# Altium project gap9_deck_v2.PrjPcb (part 2 of 2)

## Sheet 07_NINA-WIFI.SchDoc: GAP9Shield
size A3; DrawnBy: Hanna Müller and Victor Kartsch; Organization: Integrated Systems Laboratory; DocumentNumber: 7; Revision: v1.0; SheetNumber: 7; SheetTotal: 9
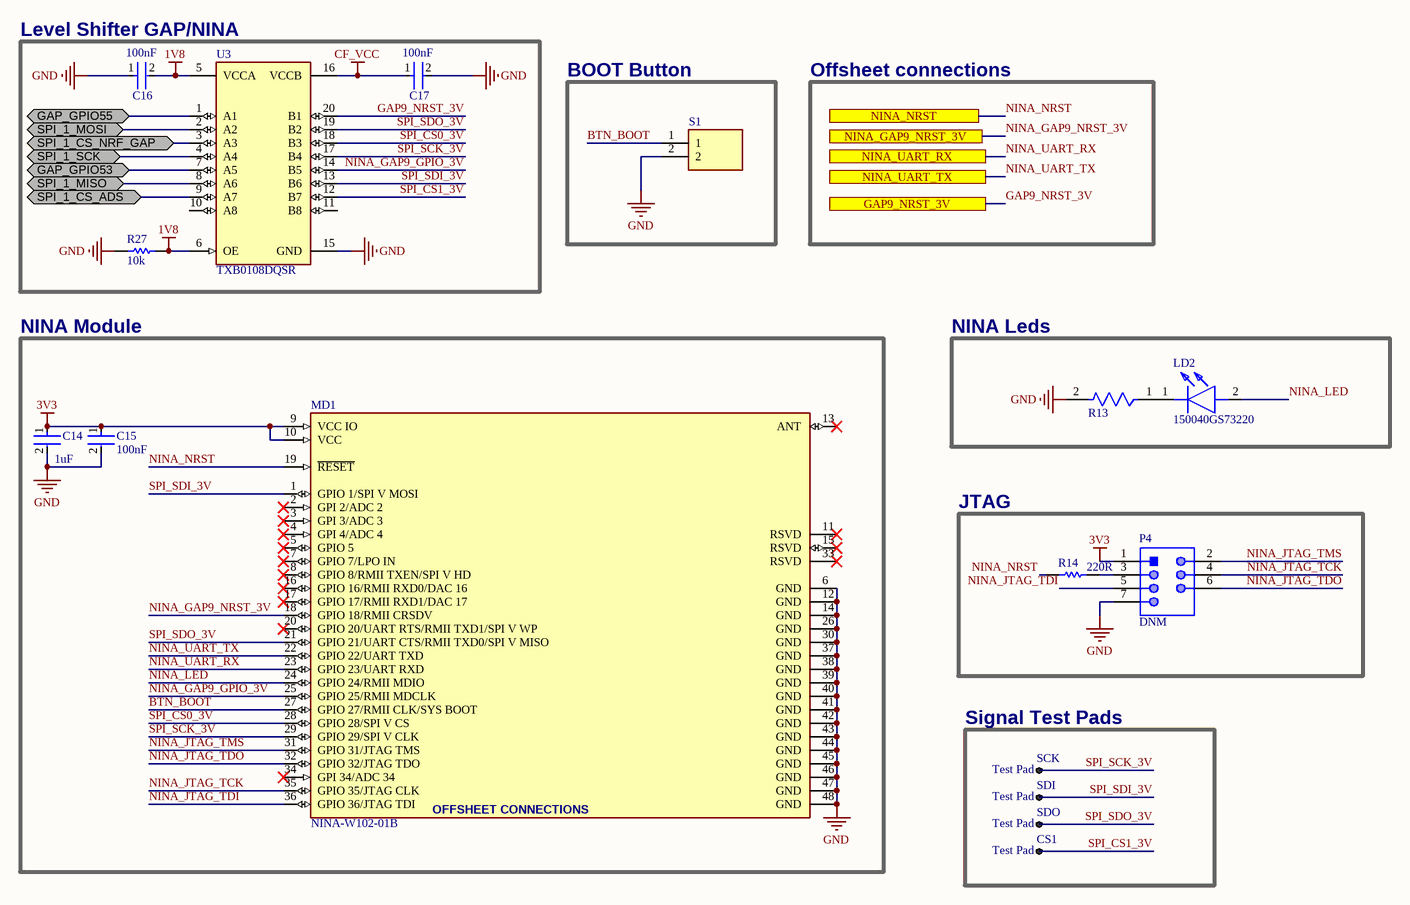
[diagram p6: 07_NINA-WIFI.SchDoc]

### Parts
C14  value 1uF  [FP-GRM155-0_05-IPC_B]  (hidden comment: GRM155R61E105MA12D)
C15  value 100nF  [FP-C1005-050-0_05-MFG]  (hidden comment: C1005X5R1E104K050BC)
C16  value 100nF  [FP-C1005-050-0_05-MFG]  (hidden comment: C1005X5R1E104K050BC)
C17  value 100nF  [FP-C1005-050-0_05-MFG]  (hidden comment: C1005X5R1E104K050BC)
CS1  Test Pad  [Pad-1.5mm]  (no BOM)
LD2  150040GS73220  [150040GS73220]
MD1  NINA-W102-01B  [FP-NINA-W102-00B-00-MFG]
P4  DNM  [JTAG_MINI]
R13  RC0201JR-070RL  [FP-RC_L0201-MFG]  (value not drawn)
R14  value 220R  [RESC0603X28X15ML05T05]  (hidden comment: CRCW0201220RFKED)
R27  value 10k  [RESC0603X28X15LL05T05]  (hidden comment: CRCW020110K0FNED)
S1  TS19-32-06-BK-70-1-SMT-TR-67  [TS193206BK701SMTTR67]  (value not drawn)
SCK  Test Pad  [Pad-1.5mm]  (no BOM)
SDI  Test Pad  [Pad-1.5mm]  (no BOM)
SDO  Test Pad  [Pad-1.5mm]  (no BOM)
U3  TXB0108DQSR  [FP-DQS0020A-MFG]

### Blocks framed on the sheet
Level Shifter GAP/NINA: C16 C17 R27 U3
BOOT Button: S1
NINA Module: C14 C15 MD1
NINA Leds: LD2 R13
JTAG: P4 R14
Signal Test Pads: CS1 SCK SDI SDO

### Ports
GAP9_NRST_3V, GAP_GPIO53 (bidir), GAP_GPIO55 (bidir), NINA_GAP9_NRST_3V, NINA_NRST, NINA_UART_RX, NINA_UART_TX, SPI_1_CS_ADS (bidir), SPI_1_CS_NRF_GAP (bidir), SPI_1_MISO (bidir), SPI_1_MOSI (bidir), SPI_1_SCK (bidir)

### Nets
1V8: C16.2 R27.1 U3.5(VCCA) U3.6(OE)
3V3: C14.1 C15.1 MD1.9(VCC_IO) MD1.10(VCC) P4.1
CF_VCC: C17.1 U3.16(VCCB)
GND: C14.2 C15.2 C16.1 C17.2 MD1.6(GND) MD1.12(GND) MD1.14(GND) MD1.26(GND) MD1.30(GND) MD1.37(GND) MD1.38(GND) MD1.39(GND) MD1.40(GND) MD1.41(GND) MD1.42(GND) MD1.43(GND) MD1.44(GND) MD1.45(GND) MD1.46(GND) MD1.47(GND) MD1.48(GND) P4.7 R13.2 R27.2 S1.2 U3.15(GND)
BTN_BOOT: MD1.27(GPIO_27/RMII_CLK/SYS_BOOT) S1.1
GAP9_NRST_3V: U3.20(B1) ; port GAP9_NRST_3V
GAP_GPIO53: U3.7(A5) ; port GAP_GPIO53
GAP_GPIO55: U3.1(A1) ; port GAP_GPIO55
NINA_GAP9_GPIO_3V: MD1.25(GPIO_25/RMII_MDCLK) U3.14(B5)
NINA_GAP9_NRST_3V: MD1.18(GPIO_18/RMII_CRSDV) ; port NINA_GAP9_NRST_3V
NINA_JTAG_TCK: MD1.35(GPIO_35/JTAG_CLK) P4.4
NINA_JTAG_TDI: MD1.36(GPIO_36/JTAG_TDI) P4.5
NINA_JTAG_TDO: MD1.32(GPIO_32/JTAG_TDO) P4.6
NINA_JTAG_TMS: MD1.31(GPIO_31/JTAG_TMS) P4.2
NINA_LED: LD2.2(A) MD1.24(GPIO_24/RMII_MDIO)
NINA_NRST: MD1.19(~{RESET}) R14.2 ; port NINA_NRST
NINA_UART_RX: MD1.23(GPIO_23/UART_RXD) ; port NINA_UART_RX
NINA_UART_TX: MD1.22(GPIO_22/UART_TXD) ; port NINA_UART_TX
SPI_1_CS_ADS: U3.9(A7) ; port SPI_1_CS_ADS
SPI_1_CS_NRF_GAP: U3.3(A3) ; port SPI_1_CS_NRF_GAP
SPI_1_MISO: U3.8(A6) ; port SPI_1_MISO
SPI_1_MOSI: U3.2(A2) ; port SPI_1_MOSI
SPI_1_SCK: U3.4(A4) ; port SPI_1_SCK
SPI_CS0_3V: MD1.28(GPIO_28/SPI_V_CS) U3.18(B3)
SPI_CS1_3V: CS1.1 U3.12(B7)
SPI_SCK_3V: MD1.29(GPIO_29/SPI_V_CLK) SCK.1 U3.17(B4)
SPI_SDI_3V: MD1.1(GPIO_1/SPI_V_MOSI) SDI.1 U3.13(B6)
SPI_SDO_3V: MD1.21(GPIO_21/UART_CTS/RMII_TXD0/SPI_V_MISO) SDO.1 U3.19(B2)
NetLD2_1: LD2.1(K) R13.1
NetP4_3: P4.3 R14.1

Not connected (* = marked no-connect by the designer): MD1 2(GPI_2/ADC_2)* 3(GPI_3/ADC_3)* 4(GPI_4/ADC_4)* 5(GPIO_5)* 7(GPIO_7/LPO_IN)* 8(GPIO_8/RMII_TXEN/SPI_V_HD)* 11(RSVD)* 13(ANT)* 15(RSVD)* 16(GPIO_16/RMII_RXD0/DAC_16)* 17(GPIO_17/RMII_RXD1/DAC_17)* 20(GPIO_20/UART_RTS/RMII_TXD1/SPI_V_WP)* 33(RSVD)* 34(GPI_34/ADC_34)*; U3 10(A8) 11(B8)

### Notes on the sheet
- Offsheet connections
- (near MD1) OFFSHEET CONNECTIONS
- 1
- 2
- 3
- 4
- 5
- 6
- 7
- 8
- A
- B
- C
- D
- Project:
- Date:
- Drawing number:
- Rev:
- Format:
- A3
- Drawn by:
- Laboratory:
- Page
- Sheet:
- of
- File:

### Library data of the parts
C14 = CMP-06035-012395-1: Chip Multilayer Ceramic Capacitors for General Purpose, 0402, 1.0uF, X5R, 15%, 20%, 25V; Weight: 0.000212oz; Dielectric: X5R; Case Code (Metric): 1005; Thickness: 0.022inch; Min Operating Temperature: -55°C; Voltage Rating (DC): 25V; Lead Free: Lead Free; Voltage Rating: 25V; Max Operating Temperature: 85°C; Case/Package: 0402; Packaging: Tape and Reel; Package Quantity: 10000; Termination: SMD/SMT; Height: 0.5mm; Width: 0.5mm; Mount: Surface Mount; Case Code (Imperial): 0402; Tolerance: 20%; Capacitance: 1uF; Length: 0.039inch
C15-C17 = CMP-2000-06000-2: Multilayer Ceramic Capacitors 100nF ±10% 25V X5R SMD 0402; Case Code (Imperial): 0402; Termination: Wraparound; Series: C; Depth: 0.5mm; Voltage Rating (DC): 25V; Contact Plating: Tin; Case Code (Metric): 1005; Dielectric: X5R; Case/Package: 0402; Voltage Rating: 25V; Packaging: Tape and Reel; Thickness: 0.022inch; Dielectric Material: Ceramic; Height: 0.5mm; Weight: 2.3E-05oz; RoHS Compliant: Yes; Width: 0.02inch; Capacitance: 100nF; Tolerance: 10%; Mount: Surface Mount; Package Quantity: 1; Max Operating Temperature: 85°C; Construction: Flat; Min Operating Temperature: -55°C; REACH SVHC: No SVHC; Resistor Type: Ceramic; Length: 1mm; Lead Free: Lead Free; Voltage: 25V
CS1 SCK SDI SDO = CMP-01283-1: 1mm SMT Test Pad; Mounting Technology: SMT
LD2 = 150040GS73220: LED; Manufacturer_Name: Wurth Elektronik; Datasheet Link: https://www.mouser.com/datasheet/2/445/150040GS73220-1714597.pdf; Height: 0.35mm; Manufacturer_Part_Number: 150040GS73220; Mouser Part Number: 710-150040GS73220; Mouser Price/Stock: https://www.mouser.co.uk/ProductDetail/Wurth-Elektronik/150040GS73220?qs=u16ybLDytRZ9vktXLUK1Kg%3D%3D
MD1 = CMP-207130-000007-1: STAND-ALONE MULTIRADIO MODULES; Manufacturer Part Number: NINA-W102-00B-00; Manufacturer: U-Blox; Max Supply Voltage: 3.6V; Number Of Adc Channels: 17; Receiving Current: 100-140mA; Nominal Supply Current: 30-190mA; Data Rate: 100Mbits/s; Max Frequency: 2.5GHz; Sensitivity: -96dBm; Min Supply Voltage: 3V; Interface: I2C,SPI,UART,CAN,Ethernet,I2S,Other; Bandwidth: 20MHz; Transmitting Current: 225-320mA; Number Of Gpio: 20; Device Class L3: Transceivers; Octopart: https://octopart.com/nina-w102-00b-00-u-blox-103157672; Automotive: No; Category: UNK; Temperature: -40°C to +85°C; Lead Free: Yes; Device Class L1: Integrated Circuits (ICs); ComponentLink2Description: Datasheet; Temperature Range Low: -40°C; Package: 0; Temperature Range High: +85°C; Digikey Description: STAND-ALONE MULTIRADIO MODULES; Device Class L2: RF Semiconductors and Devices; ComponentLink2URL: https://www.u-blox.com/sites/default/files/NINA-W10_DataSheet_%28UBX-17065507%29.pdf; RoHS: TRUE; Height: 4.2mm
P4 = JTAG_MINI: 2x10 Pin 50mil Header; PN: 20021111-00010T4LF; Supplier 1: Digi-Key; Supplier Part Number 1: 732-5374-ND
R13 = CMP-03412-023265-1: RES SMD 0 OHM JUMPER 1/20W 0201; Manufacturer: Yageo; Power Rating: 50mW; Value: 0Ω; Temperature Coefficient: 200ppm/°C; Voltage Rating: 25V; Tolerance: 5%; Octopart: https://octopart.com/rc0201jr-070rl-yageo-43171986; ComponentLink2URL: http://www.yageo.com/documents/recent/PYu-RC_Group_51_RoHS_L_10.pdf; Device Class L2: Resistors; Series: RC_L; Ipc Land Pattern Name: RESC6030X23; Temperature: -55°C to +125°C; Mouser Description: Thick Film Resistors ZERO OHM JUMPER; Footprint Url: http://www.yageo.com/exep/pages/download/literatures/PYu-R_Mount_10.pdf; RoHS: TRUE; Package: RC_L0201; Device Class L3: Chip SMD Resistors; Temperature Range Low: -55°C; Composition: Thick Film; ComponentLink2Description: Datasheet; Height: 0.26mm; Device Class L1: Passive Components; Category: Res; Resistance: 0Ω; Manufacturer Part Number: RC0201JR-070RL; Temperature Range High: +125°C; Automotive: No; Lead Free: Yes; Digikey Description: RES SMD 0 OHM JUMPER 1/20W 0201
R14 = CMP-2004-00982-1: Manufacturer: Vishay Dale; Part Number: CRCW0201220RFKED
R27 = CMP-2004-00016-1: Manufacturer: Vishay Dale; Part Number: CRCW020110K0FNED
S1 = TS19-32-06-BK-70-1-SMT-TR-67: Switch; Manufacturer_Name: CUI Devices; Datasheet Link: https://www.cuidevices.com/product/resource/ts19.pdf; Height: 0.65mm; Manufacturer_Part_Number: TS19-32-06-BK-70-1-SMT-TR-67; Mouser Part Number: 179-TS193206BK701SM; Mouser Price/Stock: https://www.mouser.co.uk/ProductDetail/CUI-Devices/TS19-32-06-BK-70-1-SMT-TR-67?qs=tlsG%2FOw5FFj0aJkgA5InKg%3D%3D
U3 = CMP-04899-000009-1: IC TRNSLTR BIDIRECTIONAL 20USON; Manufacturer: Texas Instruments; Nominal Supply Current: 0.05-3.5uA; Propagation Delay: 4ns; Max Supply Voltage: 5.5V; V A Min: 1.2V; Max Junction Temp: +150°C; Logic Function Desc: Non-Inverting; Number Of Inputs: 1; V A Max: 3.6V; Number Of Circuits: 8; V B Min: 1.65V; Standoff Height: 0mm; Data Rate: 100Mbits/s; Automotive: No; Mouser Description: Translation - Voltage Levels 8B Bidir Vltg-Level Translator; Category: IC; Temperature Range Low: -40°C; Package: DQS0020A; Manufacturer Part Number: TXB0108DQSR; ComponentLink2Description: Datasheet; Device Class L3: Voltage Level Shifters; Device Class L2: Logic ICs; Temperature Range High: +85°C; Digikey Description: IC TRNSLTR BIDIRECTIONAL 20USON; Octopart: https://octopart.com/txb0108dqsr-texas+instruments-18562890; RoHS: TRUE; Ambient Temperature Range High: +85°C; Lead Free: Yes; V B Max: 5.5V; ComponentLink2URL: https://www.ti.com/lit/ds/symlink/txb0108.pdf; Height: 0.55mm; Ambient Temperature Range Low: -40°C; Temperature: -40°C to +85°C; Number Of Outputs: 1; Min Supply Voltage: 1.2V; Device Class L1: Integrated Circuits (ICs)

## Sheet 08_CF_INTERFACE.SchDoc: GAP9Shield
size A3; DrawnBy: Hanna Müller and Victor Kartsch; Organization: Integrated Systems Laboratory; DocumentNumber: 8; Revision: v1.0; SheetNumber: 8; SheetTotal: 9
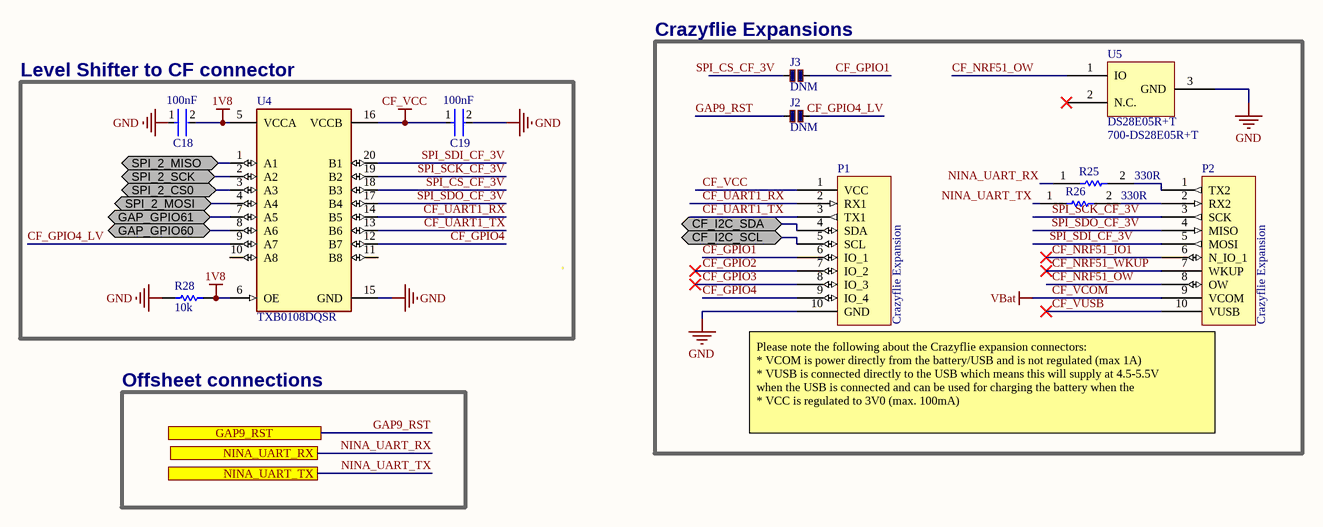
[diagram p7: 08_CF_INTERFACE.SchDoc]

### Parts
C18  value 100nF  [FP-C1005-050-0_05-MFG]  (hidden comment: C1005X5R1E104K050BC)
C19  value 100nF  [FP-C1005-050-0_05-MFG]  (hidden comment: C1005X5R1E104K050BC)
J2  DNM  [Small Solder Jumper]
J3  DNM  [Small Solder Jumper]
P1  Crazyflie Expansion  [CF2-DECK-SMD-HOLES]
P2  Crazyflie Expansion  [CF2-DECK-SMD-HOLES]
R25  value 330R  [H2C/H2R]  (hidden comment: ERJ-H2RD3300X)
R26  value 330R  [H2C/H2R]  (hidden comment: ERJ-H2RD3300X)
R28  value 10k  [RESC0603X28X15LL05T05]  (hidden comment: CRCW020110K0FNED)
U4  TXB0108DQSR  [FP-DQS0020A-MFG]
U5  DS28E05R+T  Supplier Part Number 1: 700-DS28E05R+T  [SOT23-3]

### Blocks framed on the sheet
Crazyflie Expansions: J2 J3 P1 P2 R25 R26 U5
Level Shifter to CF connector: C18 C19 R28 U4

### Ports
CF_I2C_SCL (bidir), CF_I2C_SDA (bidir), GAP9_RST, GAP_GPIO60 (bidir), GAP_GPIO61 (bidir), NINA_UART_RX, NINA_UART_TX, SPI_2_CS0 (bidir), SPI_2_MISO (bidir), SPI_2_MOSI (bidir), SPI_2_SCK (bidir)

### Nets
1V8: C18.2 R28.1 U4.5(VCCA) U4.6(OE)
CF_VCC: C19.1 P1.1(VCC) U4.16(VCCB)
CF_VCOM: P2.9(VCOM)  [also labelled VBat]
GND: C18.1 C19.2 P1.10(GND) R28.2 U4.15(GND) U5.3(GND)
CF_GPIO1: J3.1 P1.6(IO_1)
CF_GPIO2: P1.7(IO_2)
CF_GPIO3: P1.8(IO_3)
CF_GPIO4: P1.9(IO_4) U4.12(B7)
CF_GPIO4_LV: J2.1 U4.9(A7)
CF_NRF51_IO1: P2.6(N_IO_1)
CF_NRF51_OW: P2.8(OW) U5.1(IO)
CF_NRF51_WKUP: P2.7(WKUP)
CF_UART1_RX: P1.2(RX1) U4.14(B5)
CF_UART1_TX: P1.3(TX1) U4.13(B6)
CF_VUSB: P2.10(VUSB)
GAP9_RST: J2.2 ; port GAP9_RST
GAP_GPIO56: U4.2(A2) ; port SPI_2_SCK
GAP_GPIO57_NRF_P0.18: U4.3(A3) ; port SPI_2_CS0
GAP_GPIO58: U4.1(A1) ; port SPI_2_MISO
GAP_GPIO59: U4.4(A4) ; port SPI_2_MOSI
GAP_GPIO60: U4.8(A6) ; port GAP_GPIO60
GAP_GPIO61: U4.7(A5) ; port GAP_GPIO61
NINA_UART_RX: R25.1 ; port NINA_UART_RX
NINA_UART_TX: R26.1 ; port NINA_UART_TX
SPI_CS_CF_3V: J3.2 U4.18(B3)
SPI_SCK_CF_3V: P2.3(SCK) U4.19(B2)
SPI_SDI_CF_3V: P2.5(MOSI) U4.20(B1)
SPI_SDO_CF_3V: P2.4(MISO) U4.17(B4)
NetJ6_1: P1.4(SDA) ; port CF_I2C_SDA
NetJ8_1: P1.5(SCL) ; port CF_I2C_SCL
NetP2_1: P2.1(TX2) R25.2
NetP2_2: P2.2(RX2) R26.2

Not connected (* = marked no-connect by the designer): U4 10(A8) 11(B8); U5 2(N.C.)*

### Notes on the sheet
- Offsheet connections
- Please note the following about the Crazyflie expansion connectors:
  * VCOM is power directly from the battery/USB and is not regulated (max 1A)
  * VUSB is connected directly to the USB which means this will supply at 4.5-5.5V
  when the USB is connected and can be used for charging the battery when the
  * VCC is regulated to 3V0 (max. 100mA)
- 1
- 2
- 3
- 4
- 5
- 6
- 7
- 8
- A
- B
- C
- D
- Project:
- Date:
- Drawing number:
- Rev:
- Format:
- A3
- Drawn by:
- Laboratory:
- Page
- Sheet:
- of
- File:

### Library data of the parts
C18 C19 = CMP-2000-06000-2: as C15 on sheet 07_NINA-WIFI; Case Code (Imperial): 0402; Termination: Wraparound; Series: C; Depth: 0.5mm; Voltage Rating (DC): 25V; Contact Plating: Tin; Case Code (Metric): 1005; Dielectric: X5R; Case/Package: 0402; Voltage Rating: 25V; Packaging: Tape and Reel; Thickness: 0.022inch; Dielectric Material: Ceramic; Height: 0.5mm; Weight: 2.3E-05oz; RoHS Compliant: Yes; Width: 0.02inch; Capacitance: 100nF; Tolerance: 10%; Mount: Surface Mount; Package Quantity: 1; Max Operating Temperature: 85°C; Construction: Flat; Min Operating Temperature: -55°C; REACH SVHC: No SVHC; Resistor Type: Ceramic; Length: 1mm; Lead Free: Lead Free; Voltage: 25V
J2 J3 = CMP-00005-5: Technology: SMT
P1 = CF_EXP_LEFT: Supplier 1: Digi-Key; Supplier Part Number 1: 110990442-ND
P2 = CF_EXP_RIGHT: Supplier 1: Digi-Key; Supplier Part Number 1: 110990442-ND
R25 R26 = ERJ-H2RD3300X: Resistor; Manufacturer_Name: Panasonic; Datasheet Link: http://industrial.panasonic.com/cdbs/www-data/pdf/RDQ0000/ast-ind-151033.pdf; Manufacturer_Part_Number: ERJ-H2RD3300X; Mouser Part Number: 667-ERJ-H2RD3300X; Mouser Price/Stock: https://www.mouser.co.uk/ProductDetail/Panasonic/ERJ-H2RD3300X?qs=eP2BKZSCXI6Pijj457e9wg%3D%3D
R28 = CMP-2004-00016-1: Manufacturer: Vishay Dale; Part Number: CRCW020110K0FNED
U4 = CMP-04899-000009-1: as U3 on sheet 07_NINA-WIFI; Automotive: No; Mouser Description: Translation - Voltage Levels 8B Bidir Vltg-Level Translator; Category: IC; Temperature Range Low: -40°C; Package: DQS0020A; Manufacturer Part Number: TXB0108DQSR; ComponentLink2Description: Datasheet; Device Class L3: Voltage Level Shifters; Device Class L2: Logic ICs; Temperature Range High: +85°C; Digikey Description: IC TRNSLTR BIDIRECTIONAL 20USON; Octopart: https://octopart.com/txb0108dqsr-texas+instruments-18562890; RoHS: TRUE; Ambient Temperature Range High: +85°C; Lead Free: Yes; V B Max: 5.5V; ComponentLink2URL: https://www.ti.com/lit/ds/symlink/txb0108.pdf; Height: 0.55mm; Ambient Temperature Range Low: -40°C; Temperature: -40°C to +85°C; Number Of Outputs: 1; Min Supply Voltage: 1.2V; Device Class L1: Integrated Circuits (ICs)
U5 = DS28E05R+T: EEPROM 1-Wire 112-BYTE; Supplier 1: Mouser

## Sheet 09_POWER.SchDoc: GAP9Shield
size A3; DrawnBy: Hanna Müller and Victor Kartsch; Organization: Integrated Systems Laboratory; DocumentNumber: 9; Revision: v1.0; SheetNumber: 9; SheetTotal: 9
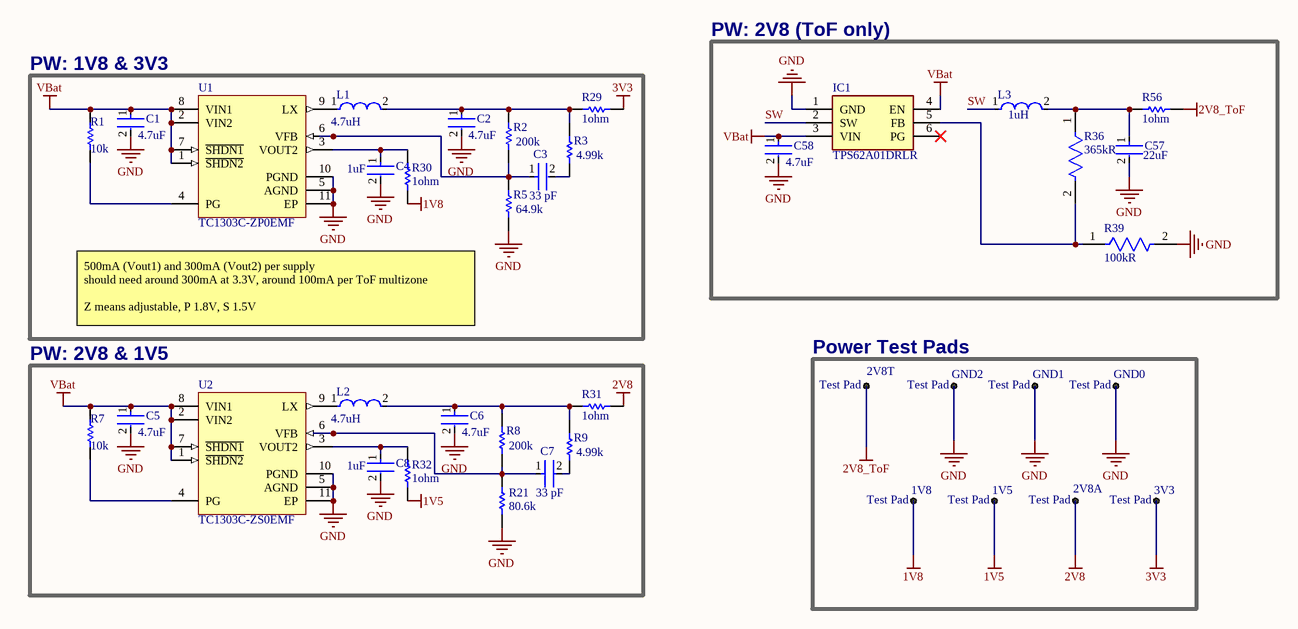
[diagram p8: 09_POWER.SchDoc]

### Parts
1V5  Test Pad  [Pad-1.5mm]  (no BOM)
1V8  Test Pad  [Pad-1.5mm]  (no BOM)
2V8A  Test Pad  [Pad-1.5mm]  (no BOM)
2V8T  Test Pad  [Pad-1.5mm]  (no BOM)
3V3  Test Pad  [Pad-1.5mm]  (no BOM)
C1  value 4.7uF  [FP-C1005-050-0_15-MFG]  (hidden comment: C1005X5R0J475K050BC)
C2  value 4.7uF  [FP-C1005-050-0_15-MFG]  (hidden comment: C1005X5R0J475K050BC)
C3  value 33 pF  [FP-C0402-BB-MFG]  (hidden comment: C0402C330J5GAC)
C4  value 1uF  [FP-GRM155-0_05-IPC_B]  (hidden comment: GRM155R61E105MA12D)
C5  value 4.7uF  [FP-C1005-050-0_15-MFG]  (hidden comment: C1005X5R0J475K050BC)
C6  value 4.7uF  [FP-C1005-050-0_15-MFG]  (hidden comment: C1005X5R0J475K050BC)
C7  value 33 pF  [FP-C0402-BB-MFG]  (hidden comment: C0402C330J5GAC)
C8  value 1uF  [FP-GRM155-0_05-IPC_B]  (hidden comment: GRM155R61E105MA12D)
C57  value 22uF  [FP-GRM158-0_2-IPC_A]  (hidden comment: GRM158R60J226ME01D)
C58  value 4.7uF  [FP-C1005-050-0_15-MFG]  (hidden comment: C1005X5R0J475K050BC)
GND0  Test Pad  [Pad-1.5mm]  (no BOM)
GND1  Test Pad  [Pad-1.5mm]  (no BOM)
GND2  Test Pad  [Pad-1.5mm]  (no BOM)
IC1  TPS62A01DRLR  [SOTFL50P160X60-6N]
L1  Inductance: 4.7uH  [FP-LQM18FN_00-IPC_A]  (hidden comment: LQM18FN4R7M00D)
L2  Inductance: 4.7uH  [FP-LQM18FN_00-IPC_A]  (hidden comment: LQM18FN4R7M00D)
L3  value 1uH  [FP-CBL2012-MFG]  (hidden comment: CBL2012T1R0M)
R1  value 10k  [RESC0603X28X15LL05T05]  (hidden comment: CRCW020110K0FNED)
R2  value 200k  [RESC0603X28X15NL05T05]  (hidden comment: CRCW0201200KFKED)
R3  value 4.99k  [RESC0603X28X15ML05T05]  (hidden comment: CRCW02014K99FKED)
R5  value 64.9k  [RESC0603X28X15LL05T05]  (hidden comment: CRCW020164K9FKED)
R7  value 10k  [RESC0603X28X15LL05T05]  (hidden comment: CRCW020110K0FNED)
R8  value 200k  [RESC0603X28X15NL05T05]  (hidden comment: CRCW0201200KFKED)
R9  value 4.99k  [RESC0603X28X15ML05T05]  (hidden comment: CRCW02014K99FKED)
R21  value 80.6k  [RESC0603X28X15NL05T05]  (hidden comment: CRCW020180K6FNED)
R29  value 1ohm  [RESC1005X40X25ML05T10]  (hidden comment: CRCW04021R00FKEDHP)
R30  value 1ohm  [RESC1005X40X25ML05T10]  (hidden comment: CRCW04021R00FKEDHP)
R31  value 1ohm  [RESC1005X40X25ML05T10]  (hidden comment: CRCW04021R00FKEDHP)
R32  value 1ohm  [RESC1005X40X25ML05T10]  (hidden comment: CRCW04021R00FKEDHP)
R36  value 365kR  [FP-CR0402-IPC_A]  (hidden comment: CR0402-FX-3653GLF)
R39  value 100kR  [FP-ERJ2RK-IPC_C]  (hidden comment: ERJ-2RKF1003X)
R56  value 1ohm  [RESC1005X40X25ML05T10]  (hidden comment: CRCW04021R00FKEDHP)
U1  TC1303C-ZP0EMF  [DFN-MF10]
U2  TC1303C-ZS0EMF  [DFN-MF10]

### Blocks framed on the sheet
PW: 1V8 & 3V3: C1-C4 L1 R1-R3 R5 R29 R30 U1
PW: 2V8 (ToF only): C57 C58 IC1 L3 R36 R39 R56
Power Test Pads: 1V5 1V8 2V8A 2V8T 3V3 GND0-GND2
PW: 2V8 & 1V5: C5-C8 L2 R7-R9 R21 R31 R32 U2

### Nets
1V5: 1V5.1 R32.2
1V8: 1V8.1 R30.2
2V8: 2V8A.1 R31.1
2V8_ToF: 2V8T.1 R56.1
3V3: 3V3.1 R29.1
GND: C1.2 C2.2 C4.2 C5.2 C6.2 C8.2 C57.2 C58.2 GND0.1 GND1.1 GND2.1 IC1.1(GND) R5.1 R21.1 R39.2 U1.5(AGND) U1.10(PGND) U1.11(EP) U2.5(AGND) U2.10(PGND) U2.11(EP)
VBat: C1.1 C5.1 C58.1 IC1.3(VIN) IC1.4(EN) R1.2 R7.2 U1.1(~{SHDN2}) U1.2(VIN2) U1.7(~{SHDN1}) U1.8(VIN1) U2.1(~{SHDN2}) U2.2(VIN2) U2.7(~{SHDN1}) U2.8(VIN1)  [project net CF_VCOM]
SW: IC1.2(SW) L3.1
NetC2_1: C2.1 L1.2 R2.2 R3.2 R29.2
NetC3_1: C3.1 R2.1 R5.2 U1.6(VFB)
NetC3_2: C3.2 R3.1
NetC4_1: C4.1 R30.1 U1.3(VOUT2)
NetC6_1: C6.1 L2.2 R8.2 R9.2 R31.2
NetC7_1: C7.1 R8.1 R21.2 U2.6(VFB)
NetC7_2: C7.2 R9.1
NetC8_1: C8.1 R32.1 U2.3(VOUT2)
NetC57_1: C57.1 L3.2 R36.1 R56.2
NetIC1_5: IC1.5(FB) R36.2 R39.1
NetL1_1: L1.1 U1.9(LX)
NetL2_1: L2.1 U2.9(LX)
NetR1_1: R1.1 U1.4(PG)
NetR7_1: R7.1 U2.4(PG)

Not connected (* = marked no-connect by the designer): IC1 6(PG)*

### Notes on the sheet
- 500mA (Vout1) and 300mA (Vout2) per supply
  should need around 300mA at 3.3V, around 100mA per ToF multizone
  Z means adjustable, P 1.8V, S 1.5V
- 1
- 2
- 3
- 4
- 5
- 6
- 7
- 8
- A
- B
- C
- D
- Project:
- Date:
- Drawing number:
- Rev:
- Format:
- A3
- Drawn by:
- Laboratory:
- Page
- Sheet:
- of
- File:

### Library data of the parts
1V5 1V8 2V8A 2V8T 3V3 GND0-GND2 = CMP-01283-1: 1mm SMT Test Pad; Mounting Technology: SMT
C1 C2 C5 C6 C58 = CMP-2000-05437-2: CAP CER 4.7UF 6.3V X5R 0402; Tolerance: 10%; Dielectric Material: Ceramic; Voltage: 6.3V; Capacitance: 4.7uF; Depth: 0.5mm; Height: 0.5mm; Length: 1mm; Termination: SMD/SMT; RoHS Compliant: Yes; Series: C; Case/Package: 0402; Dielectric: X5R; Lead Free: Lead Free; Mount: Surface Mount; Max Operating Temperature: 85°C; Min Operating Temperature: -55°C
C3 C7 = CMP-03020-007781-1: C0402 33 pF C0G 5.00% 50 V; Manufacturer: Kemet; Voltage Rating: 50 V; Material: Ceramic; Temperature Coefficient: 15%; Tolerance: 0.05; Package: C0402-BB; Temperature Range High: +125°C; Device Class L3: Ceramic Capacitors; RoHS: TRUE; ComponentLink2Description: Datasheet; Device Class L1: Passive Components; Octopart: https://octopart.com/c0402c330j5gac-kemet-2551464; Automotive: No; Temperature: -55°C to +125°C; Mouser Description: Capacitor, 33PF 50V Npo 0402CAPACITOR, 33PF 50V Npo 0402; Capacitance: 33PF; Voltage Rating, DC: 50V; Capacitor...; Temperature Range Low: -55°C; Lead Free: Yes; Manufacturer Part Number: C0402C330J5GAC; Device Class L2: Capacitors; Ipc Land Pattern Name: CAPC10050X50; ComponentLink2URL: https://content.kemet.com/datasheets/KEM_C1002_X7R_SMD.pdf; Height: 0.55mm; Temperature Characteristic: C0G; Capacitance: 33 pF; Category: Cap
C4 C8 = CMP-06035-012395-1: as C14 on sheet 07_NINA-WIFI; Weight: 0.000212oz; Dielectric: X5R; Case Code (Metric): 1005; Thickness: 0.022inch; Min Operating Temperature: -55°C; Voltage Rating (DC): 25V; Lead Free: Lead Free; Voltage Rating: 25V; Max Operating Temperature: 85°C; Case/Package: 0402; Packaging: Tape and Reel; Package Quantity: 10000; Termination: SMD/SMT; Height: 0.5mm; Width: 0.5mm; Mount: Surface Mount; Case Code (Imperial): 0402; Tolerance: 20%; Capacitance: 1uF; Length: 0.039inch
C57 = CMP-06035-062950-1: CAP CER 22UF 6.3V X5R 0402
IC1 = TPS62A01DRLR: Integrated Circuit; Manufacturer_Name: Texas Instruments; Datasheet Link: https://www.arrow.com/en/products/tps62a01drlr/texas-instruments?region=nac; Height: 0.6mm; Manufacturer_Part_Number: TPS62A01DRLR; Mouser Part Number: 595-TPS62A01DRLR; Mouser Price/Stock: https://www.mouser.co.uk/ProductDetail/Texas-Instruments/TPS62A01DRLR?qs=Znm5pLBrcALcIfh%2FYrJRtw%3D%3D; Arrow Part Number: TPS62A01DRLR; Arrow Price/Stock: https://www.arrow.com/en/products/tps62a01drlr/texas-instruments?region=nac
L1 L2 = CMP-06042-016387-1: FIXED IND 4.7UH 80MA 600 MOHM; Self Resonant Frequency: 50MHz; Core Material: Ferrite; DC Resistance (DCR): 600mR; Test Frequency: 1MHz; Shielding: Shielded; Tolerance: 20%; Max DC Current: 80mA; Width: 0.031inch; RoHS Compliant: Yes; Packaging: Tape and Reel; Case Code (Metric): 1608; Weight: 7.1E-05oz; Lead Free: Lead Free; DC Current: 80mA; Height - Seated (Max): 0.035inch; Rated Current-Max: 80mA; Max Operating Temperature: 125°C; Height: 0.8mm; Radiation Hardening: No; Current Rating: 80mA; Package Quantity: 4000; Case Code (Imperial): 0603; Case/Package: 0603; Termination: SMD/SMT; Min Operating Temperature: -55°C; Mount: Surface Mount; Series: LQM18F; Saturation Current: 80mA; Depth: 0.9mm; Military Standard: Not; Length: 1.6mm; value: 4.7 uH
L3 = CMP-14484-000072-1: FIXED IND 1UH 950MA 195 MOHM SMD; Inductor Type: POWER; Shielding: Unshielded; Inductance Tolerance: 20%; Self Resonant Frequency: 100MHz; Test Frequency: 100kHz; DC Resistance (DCR): 195mR; Saturation Current: 620mA; Core Material: Ferrite; Case Code (Metric): 2012; RoHS Compliant: Yes; Length: 0.079inch; Termination: SMD/SMT; Series: CB; Resistor Type: Wirewound; Number of Pins: 2; Lead Free: Exempt; Depth: 1.45mm; Package Quantity: 4000; Packaging: Tape and Reel; Height - Seated (Max): 0.039inch; Max Operating Temperature: 105°C; Case/Package: 0805; Case Code (Imperial): 0805; Width: 0.049inch; Halogen Free: Halogen Free; Mount: Surface Mount; Tolerance: 20%; Radiation Hardening: No; Current Rating: 950mA; Min Operating Temperature: -40°C; Inductance: 1uH; Max DC Current: 950mA; Height: 0.9mm
R1 R7 = CMP-2004-00016-1: Manufacturer: Vishay Dale; Part Number: CRCW020110K0FNED
R2 R8 = CMP-2004-00281-1: Manufacturer: Vishay Dale; Part Number: CRCW0201200KFKED
R3 R9 = CMP-2004-00678-1: Manufacturer: Vishay Dale; Part Number: CRCW02014K99FKED
R5 = CMP-1010-00621-2: Manufacturer: Vishay Dale; Part Number: CRCW020164K9FKED
R21 = CMP-2004-00882-1: Manufacturer: Vishay Dale; Part Number: CRCW020180K6FNED
R29-R32 R56 = CMP-2002-03047-1: Manufacturer: Vishay Dale; Part Number: CRCW04021R00FKEDHP
R36 = CMP-2002-05125-2: Thick Film Chip Resistors 0402 365kΩ 0.0625W 1% 100ppm/°C; Max Power Dissipation: 63mW; Package Quantity: 10000; Min Operating Temperature: -55°C; Resistance: 365kR; Thickness: 356um; Mount: Surface Mount; Number of Terminations: 2; Tolerance: 1%; Packaging: Tape and Reel; Max Operating Temperature: 155°C; Temperature Coefficient: 100ppm/°C; Resistor Type: Thick Film; Case/Package: 0402; Series: CR0402; Height: 0.016inch; RoHS Compliant: Yes; Width: 0.02inch; Length: 0.039inch
R39 = CMP-2002-00608-4: RES SMD 100K OHM 1% 1/10W 0402; Voltage Rating (DC): 50V; Power Rating: 100mW; Temperature Coefficient: 100ppm/°C; Case/Package: 0402; Length: 1mm; Package Quantity: 1; Radiation Hardening: No; Case Code (Metric): 1005; Contact Plating: Tin; Mount: Surface Mount; Depth: 0.5mm; Resistance: 100kR; Max Operating Temperature: 155°C; Lead Free: Lead Free; Width: 0.5mm; Composition: Thick Film; Case Code (Imperial): 0402; Tolerance: 1%; Termination: SMD/SMT; Number of Pins: 2; Height: 0.35mm; Voltage Rating: 50V; Military Standard: Not; REACH SVHC: No SVHC; Packaging: Tape and Reel; Min Operating Temperature: -55°C; Max Power Dissipation: 100mW; Features: Automotive AEC-Q200; Number of Terminations: 2
U1 = CMP-0139-00073-1: 500mA Synchronous Buck Regulator + 300mA LDO with Power-Good Output, Adjustable, 1.8V, 10-Pin DFN, Industrial Temperature; PackageVersion: revBB, Aug-2009; PackageDescription: 10-Lead Plastic Dual Flat, No Lead Package (MF) - 3x3x0.9mm Body [DFN]; PackageReference: DFN-MF10; DatasheetVersion: revB, Jul-2005
U2 = CMP-0139-00077-1: 500mA Synchronous Buck Regulator + 300mA LDO with Power-Good Output, Adjustable, 1.5V, 10-Pin DFN, Industrial Temperature; PackageDescription: 10-Lead Plastic Dual Flat, No Lead Package (MF) - 3x3x0.9mm Body [DFN]; PackageVersion: revBB, Aug-2009; DatasheetVersion: revB, Jul-2005; PackageReference: DFN-MF10

## Nets that join several sheets
1V5: 01_GAP9_INTERFACE (FB2.2), 09_POWER (1V5.1 R32.2)
1V8: 01_GAP9_INTERFACE (11 pins), 02_GAP9_CHIP_POWER (20 pins), 03_GAP9_CHIP_JTAG_XTALs (R37.2), 04_GAP9_CHIP_MEM (R38.1), 05_GAP9_CHIP_GPIO (R40.2 R41.2), 06_TOFs (C48.2 R11.2 U9.1 U9.5), 07_NINA-WIFI (C16.2 R27.1 U3.5 U3.6), 08_CF_INTERFACE (C18.2 R28.1 U4.5 U4.6), 09_POWER (1V8.1 R30.2)
2V8: 01_GAP9_INTERFACE (FB1.2 J1.3 Y1.1 Y1.4), 09_POWER (2V8A.1 R31.1)
2V8_ToF: 06_TOFs (12 pins), 09_POWER (2V8T.1 R56.1)
3V3: 01_GAP9_INTERFACE (R33.2), 07_NINA-WIFI (5 pins), 09_POWER (3V3.1 R29.1)
CF_VCC: 07_NINA-WIFI (C17.1 U3.16), 08_CF_INTERFACE (C19.1 P1.1 U4.16)
CF_VCOM: 08_CF_INTERFACE (P2.9), 09_POWER (15 pins)
GND: 01_GAP9_INTERFACE (14 pins), 02_GAP9_CHIP_POWER (36 pins), 03_GAP9_CHIP_JTAG_XTALs (5 pins), 04_GAP9_CHIP_MEM (12 pins), 05_GAP9_CHIP_GPIO (R42.1 R43.1), 06_TOFs (27 pins), 07_NINA-WIFI (26 pins), 08_CF_INTERFACE (6 pins), 09_POWER (21 pins)
CAM_CLK_N: 01_GAP9_INTERFACE (X1.16), 04_GAP9_CHIP_MEM (GAP9.E7)
CAM_CLK_P: 01_GAP9_INTERFACE (X1.14), 04_GAP9_CHIP_MEM (GAP9.D7)
CAM_D0_N: 01_GAP9_INTERFACE (X1.20), 04_GAP9_CHIP_MEM (GAP9.C6)
CAM_D0_P: 01_GAP9_INTERFACE (X1.18), 04_GAP9_CHIP_MEM (GAP9.B6)
GAP9_NRST_3V: 01_GAP9_INTERFACE (R34.2 R35.2), 07_NINA-WIFI (U3.20)
GAP9_RST: 01_GAP9_INTERFACE (R23.2 R24.2), 03_GAP9_CHIP_JTAG_XTALs (GAP9.F2), 08_CF_INTERFACE (J2.2)
GAP_GPIO52: 01_GAP9_INTERFACE (IO52.1 LD1.2), 05_GAP9_CHIP_GPIO (GAP9.J6)
GAP_GPIO53: 01_GAP9_INTERFACE (IO53.1), 05_GAP9_CHIP_GPIO (GAP9.H7), 07_NINA-WIFI (U3.7)
GAP_GPIO55: 05_GAP9_CHIP_GPIO (GAP9.K7), 07_NINA-WIFI (U3.1)
GAP_GPIO56: 05_GAP9_CHIP_GPIO (GAP9.H1), 08_CF_INTERFACE (U4.2)
GAP_GPIO57_NRF_P0.18: 05_GAP9_CHIP_GPIO (GAP9.H2), 08_CF_INTERFACE (U4.3)
GAP_GPIO58: 05_GAP9_CHIP_GPIO (GAP9.H3), 08_CF_INTERFACE (U4.1)
GAP_GPIO59: 05_GAP9_CHIP_GPIO (GAP9.H4), 08_CF_INTERFACE (U4.4)
GAP_GPIO60: 05_GAP9_CHIP_GPIO (GAP9.J4), 08_CF_INTERFACE (U4.8)
GAP_GPIO61: 05_GAP9_CHIP_GPIO (GAP9.J3), 08_CF_INTERFACE (U4.7)
GAP_GPIO62: 01_GAP9_INTERFACE (IO62.1), 05_GAP9_CHIP_GPIO (GAP9.J1)
GAP_GPIO63: 01_GAP9_INTERFACE (IO63.1), 05_GAP9_CHIP_GPIO (GAP9.J2)
GAP_GPIO89: 02_GAP9_CHIP_POWER (R46.2), 05_GAP9_CHIP_GPIO (GAP9.A2)
I2C_0_SCL: 01_GAP9_INTERFACE (R52.2 SCL0.1), 05_GAP9_CHIP_GPIO (GAP9.D2), 06_TOFs (U9.3)
I2C_0_SDA: 01_GAP9_INTERFACE (R51.2 SDA0.1), 05_GAP9_CHIP_GPIO (GAP9.B1), 06_TOFs (U9.2)
I2C_1_SCL: 01_GAP9_INTERFACE (R50.2 SCL1.1), 05_GAP9_CHIP_GPIO (GAP9.C1)
I2C_1_SDA: 01_GAP9_INTERFACE (R49.2 SDA1.1), 05_GAP9_CHIP_GPIO (GAP9.F4)
I2C_2_SCL: 01_GAP9_INTERFACE (R48.2 SCL2.1), 05_GAP9_CHIP_GPIO (GAP9.G5)
I2C_2_SDA: 01_GAP9_INTERFACE (R47.2 SDA2.1), 05_GAP9_CHIP_GPIO (GAP9.K4)
I2C_3_SCL: 01_GAP9_INTERFACE (R22.1 X1.22), 05_GAP9_CHIP_GPIO (GAP9.J5)
I2C_3_SDA: 01_GAP9_INTERFACE (R20.1 X1.24), 05_GAP9_CHIP_GPIO (GAP9.H5)
JTAG_TCK: 01_GAP9_INTERFACE (R16.2), 03_GAP9_CHIP_JTAG_XTALs (GAP9.G4)
JTAG_TDI: 01_GAP9_INTERFACE (R18.2), 03_GAP9_CHIP_JTAG_XTALs (GAP9.E2)
JTAG_TDO: 01_GAP9_INTERFACE (R17.2), 03_GAP9_CHIP_JTAG_XTALs (GAP9.F3)
JTAG_TMS: 01_GAP9_INTERFACE (R15.2), 03_GAP9_CHIP_JTAG_XTALs (GAP9.D1)
NetJ6_1: 06_TOFs (J6.1), 08_CF_INTERFACE (P1.4)
NetJ8_1: 06_TOFs (J8.1), 08_CF_INTERFACE (P1.5)
NetP3_7: 01_GAP9_INTERFACE (P3.7), 05_GAP9_CHIP_GPIO (R54.1)
NINA_GAP9_NRST_3V: 01_GAP9_INTERFACE (R35.1), 07_NINA-WIFI (MD1.18)
NINA_NRST: 01_GAP9_INTERFACE (C20.1 R33.1 R34.1), 07_NINA-WIFI (MD1.19 R14.2)
NINA_UART_RX: 07_NINA-WIFI (MD1.23), 08_CF_INTERFACE (R25.1)
NINA_UART_TX: 07_NINA-WIFI (MD1.22), 08_CF_INTERFACE (R26.1)
RESET_N: 01_GAP9_INTERFACE (R19.2), 03_GAP9_CHIP_JTAG_XTALs (GAP9.D4 R37.1)
SPI_1_CS_ADS: 05_GAP9_CHIP_GPIO (GAP9.E4), 07_NINA-WIFI (U3.9)
SPI_1_CS_NRF_GAP: 05_GAP9_CHIP_GPIO (GAP9.C2), 07_NINA-WIFI (U3.3)
SPI_1_MISO: 05_GAP9_CHIP_GPIO (GAP9.E3), 07_NINA-WIFI (U3.8)
SPI_1_MOSI: 05_GAP9_CHIP_GPIO (GAP9.A1), 07_NINA-WIFI (U3.2)
SPI_1_SCK: 05_GAP9_CHIP_GPIO (GAP9.B2), 07_NINA-WIFI (U3.4)